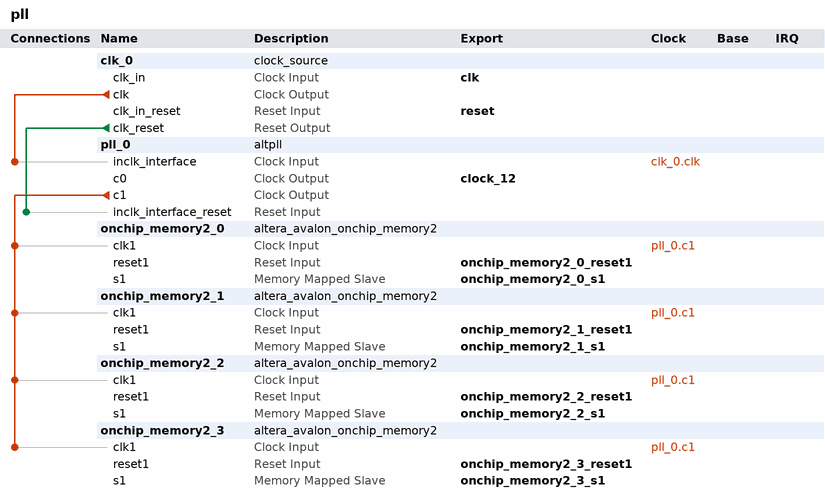
[diagram p0: system contents]
# Platform Designer (Qsys) system pll, Cyclone IV E EP4CE115F29C7
# Parameters at their usual value, and those the tool derives, are not listed.
package require -exact qsys 18.1
create_system pll
set_project_property DEVICE_FAMILY {Cyclone IV E}
set_project_property DEVICE EP4CE115F29C7

add_instance clk_0 clock_source 18.1
set_instance_parameter_value clk_0 clockFrequency 50000000

add_instance pll_0 altpll 18.1
set_instance_parameter_value pll_0 CLK0_DIVIDE_BY 25
set_instance_parameter_value pll_0 CLK0_MULTIPLY_BY 6
set_instance_parameter_value pll_0 CLK1_DIVIDE_BY 25
set_instance_parameter_value pll_0 CLK1_DUTY_CYCLE 50
set_instance_parameter_value pll_0 CLK1_MULTIPLY_BY 6
set_instance_parameter_value pll_0 CLK1_PHASE_SHIFT 0
set_instance_parameter_value pll_0 INCLK0_INPUT_FREQUENCY 20000
set_instance_parameter_value pll_0 PORT_ARESET PORT_UNUSED
set_instance_parameter_value pll_0 PORT_LOCKED PORT_UNUSED
set_instance_parameter_value pll_0 PORT_clk1 PORT_USED
set_instance_parameter_value pll_0 PORT_clk2 PORT_UNUSED
set_instance_parameter_value pll_0 PORT_clk3 PORT_UNUSED

add_instance onchip_memory2_0 altera_avalon_onchip_memory2 18.1
set_instance_parameter_value onchip_memory2_0 dataWidth 16
set_instance_parameter_value onchip_memory2_0 dualPort false
set_instance_parameter_value onchip_memory2_0 initMemContent true
set_instance_parameter_value onchip_memory2_0 initializationFileName D:/fpga-synthesizer/waves/sin.mif
set_instance_parameter_value onchip_memory2_0 memorySize 512
set_instance_parameter_value onchip_memory2_0 useNonDefaultInitFile true
set_instance_parameter_value onchip_memory2_0 writable false

add_instance onchip_memory2_1 altera_avalon_onchip_memory2 18.1
set_instance_parameter_value onchip_memory2_1 dataWidth 16
set_instance_parameter_value onchip_memory2_1 dualPort false
set_instance_parameter_value onchip_memory2_1 initMemContent true
set_instance_parameter_value onchip_memory2_1 initializationFileName D:/fpga-synthesizer/waves/cello.mif
set_instance_parameter_value onchip_memory2_1 memorySize 512
set_instance_parameter_value onchip_memory2_1 useNonDefaultInitFile true
set_instance_parameter_value onchip_memory2_1 writable false

add_instance onchip_memory2_2 altera_avalon_onchip_memory2 18.1
set_instance_parameter_value onchip_memory2_2 dataWidth 16
set_instance_parameter_value onchip_memory2_2 dualPort false
set_instance_parameter_value onchip_memory2_2 initMemContent true
set_instance_parameter_value onchip_memory2_2 initializationFileName D:/fpga-synthesizer/waves/sawtooth.mif
set_instance_parameter_value onchip_memory2_2 memorySize 512
set_instance_parameter_value onchip_memory2_2 useNonDefaultInitFile true
set_instance_parameter_value onchip_memory2_2 writable false

add_instance onchip_memory2_3 altera_avalon_onchip_memory2 18.1
set_instance_parameter_value onchip_memory2_3 dataWidth 16
set_instance_parameter_value onchip_memory2_3 dualPort false
set_instance_parameter_value onchip_memory2_3 initMemContent true
set_instance_parameter_value onchip_memory2_3 initializationFileName D:/fpga-synthesizer/waves/guitar.mif
set_instance_parameter_value onchip_memory2_3 memorySize 512
set_instance_parameter_value onchip_memory2_3 useNonDefaultInitFile true
set_instance_parameter_value onchip_memory2_3 writable false

# connections
add_connection clk_0.clk pll_0.inclk_interface clock
add_connection pll_0.c1 onchip_memory2_0.clk1 clock
add_connection pll_0.c1 onchip_memory2_1.clk1 clock
add_connection pll_0.c1 onchip_memory2_2.clk1 clock
add_connection pll_0.c1 onchip_memory2_3.clk1 clock
add_connection clk_0.clk_reset pll_0.inclk_interface_reset reset

# exported interfaces
add_interface clk clock sink
set_interface_property clk EXPORT_OF clk_0.clk_in
add_interface clock_12 clock source
set_interface_property clock_12 EXPORT_OF pll_0.c0
add_interface onchip_memory2_0_reset1 reset sink
set_interface_property onchip_memory2_0_reset1 EXPORT_OF onchip_memory2_0.reset1
add_interface onchip_memory2_0_s1 avalon slave
set_interface_property onchip_memory2_0_s1 EXPORT_OF onchip_memory2_0.s1
add_interface onchip_memory2_1_reset1 reset sink
set_interface_property onchip_memory2_1_reset1 EXPORT_OF onchip_memory2_1.reset1
add_interface onchip_memory2_1_s1 avalon slave
set_interface_property onchip_memory2_1_s1 EXPORT_OF onchip_memory2_1.s1
add_interface onchip_memory2_2_reset1 reset sink
set_interface_property onchip_memory2_2_reset1 EXPORT_OF onchip_memory2_2.reset1
add_interface onchip_memory2_2_s1 avalon slave
set_interface_property onchip_memory2_2_s1 EXPORT_OF onchip_memory2_2.s1
add_interface onchip_memory2_3_reset1 reset sink
set_interface_property onchip_memory2_3_reset1 EXPORT_OF onchip_memory2_3.reset1
add_interface onchip_memory2_3_s1 avalon slave
set_interface_property onchip_memory2_3_s1 EXPORT_OF onchip_memory2_3.s1
add_interface reset reset sink
set_interface_property reset EXPORT_OF clk_0.clk_in_reset

set_interconnect_requirement {$system} qsys_mm.clockCrossingAdapter HANDSHAKE
set_interconnect_requirement {$system} qsys_mm.enableEccProtection FALSE
set_interconnect_requirement {$system} qsys_mm.insertDefaultSlave FALSE
set_interconnect_requirement {$system} qsys_mm.maxAdditionalLatency 1

save_system pll.qsys
